# EAGLE design Light bar (EAGLE 7.2.0)
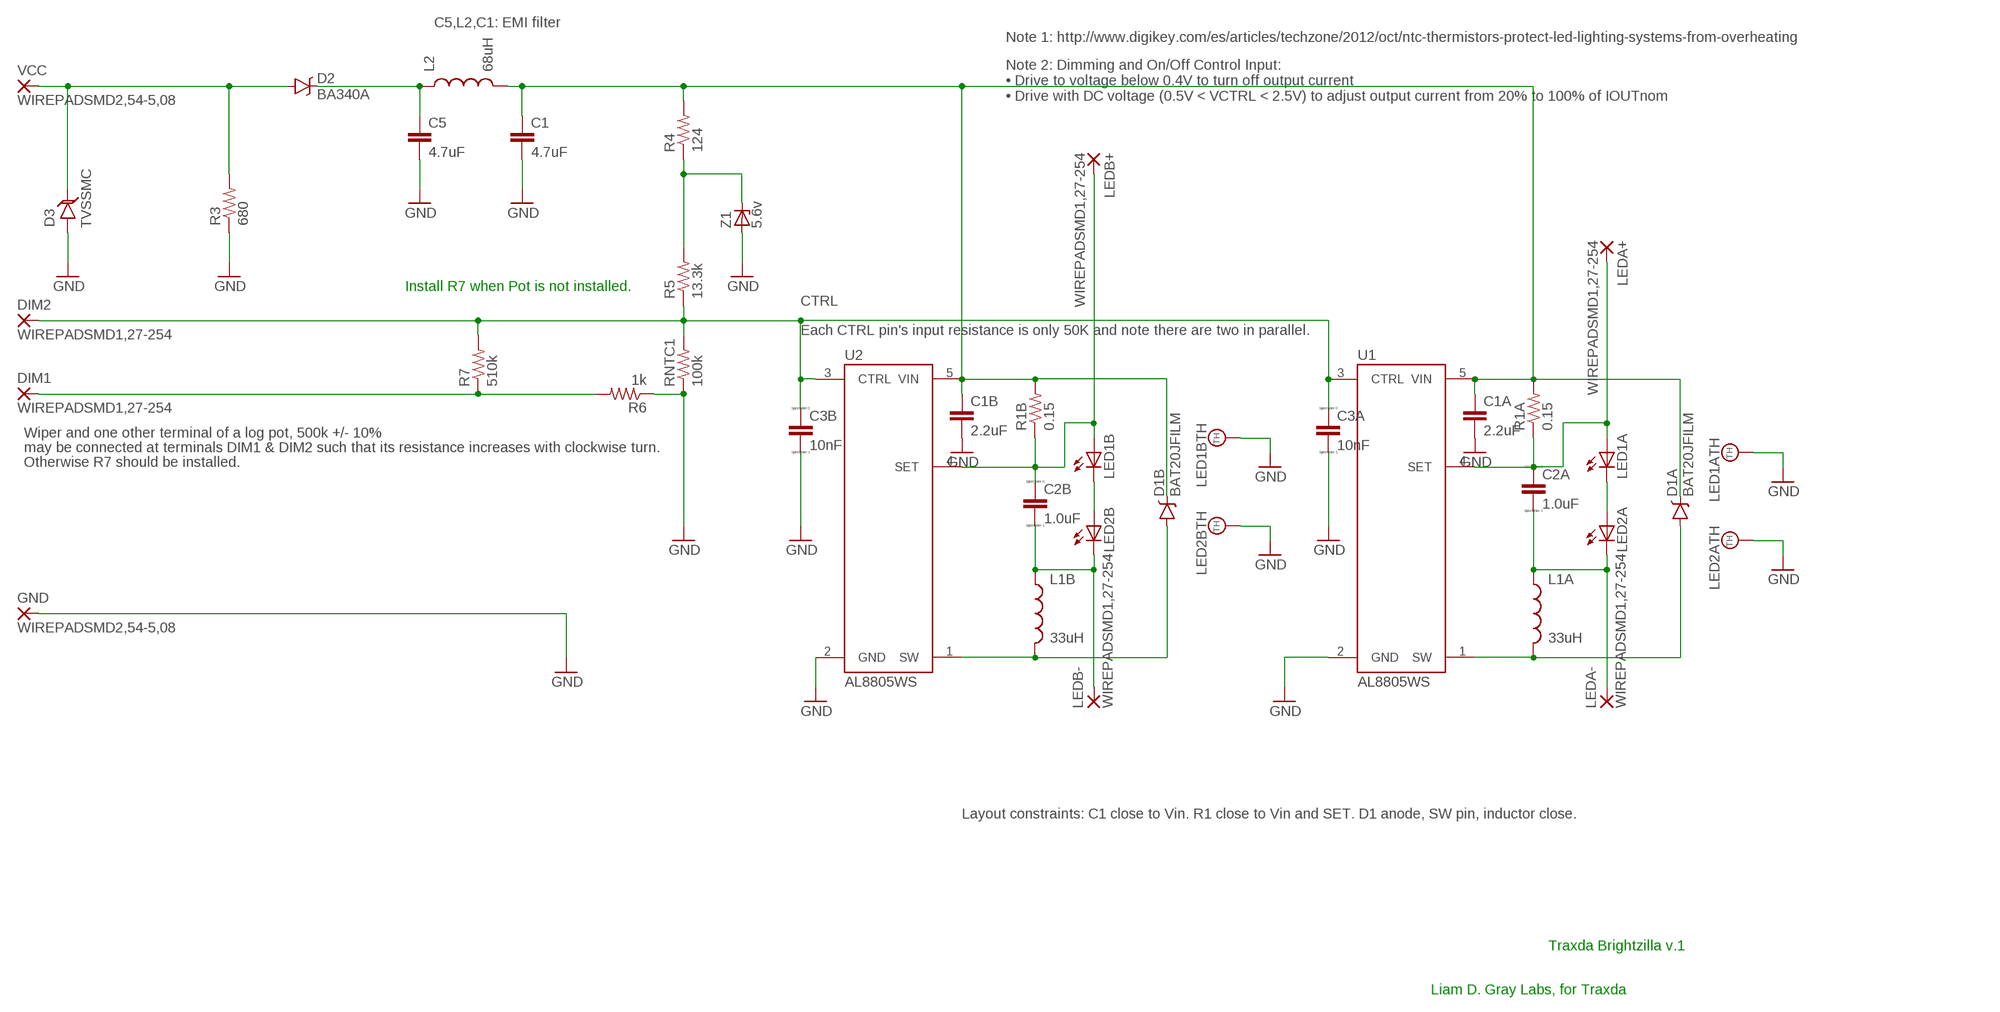
[diagram p0: schematic, sheet 1]

## Parts
C1  4.7uF  CAP1210  [1210]
C1A  2.2uF  2.2UF-25V-+80/-20(0805)  [0805]
C1B  2.2uF  2.2UF-25V-+80/-20(0805)  [0805]
C2A  1.0uF  1.0UF-25V-+80/-20(0805)  [0805]
C2B  1.0uF  1.0UF-25V-+80/-20(0805)  [0805]
C3A  10nF  10NF/10000PF-50V-10%(0603)  [0603-CAP]
C3B  10nF  CAP0603-CAP  [0603-CAP]
C5  4.7uF  CAP1210  [1210]
D1A  BAT20JFILM  [SOD-323]
D1B  BAT20JFILM  [SOD-323]
D2  BA340A  B340A  [SMA-DIODE]
D3  TVSSMC  [SMC]
DIM1  WIREPADSMD1,27-254  [SMD1,27-2,54]
DIM2  WIREPADSMD1,27-254  [SMD1,27-2,54]
GND  WIREPADSMD2,54-5,08  [SMD2,54-5,08]
L1A  33uH  INDUCTORNR6045T330MYUDEN_NR6045  [NR6045]
L1B  33uH  INDUCTORNR6045T330MYUDEN_NR6045  [NR6045]
L2  68uH  INDUCTORBOURNS_SRR1260  [SRR1260]
LED1A  LUXEON_REBEL  [LUXEON_REBEL_32MIL12MIL]
LED1B  LUXEON_REBEL  [LUXEON_REBEL_32MIL12MIL]
LED2A  LUXEON_REBEL  [LUXEON_REBEL_32MIL12MIL]
LED2B  LUXEON_REBEL  [LUXEON_REBEL_32MIL12MIL]
LEDA+  WIREPADSMD1,27-254  [SMD1,27-2,54]
LEDA-  WIREPADSMD1,27-254  [SMD1,27-2,54]
LEDB+  WIREPADSMD1,27-254  [SMD1,27-2,54]
LEDB-  WIREPADSMD1,27-254  [SMD1,27-2,54]
R1A  0.15  0.3OHM-1/8W-1%(0805)  [0805]
R1B  0.15  0.3OHM-1/8W-1%(0805)  [0805]
R3  680  RESISTOR2512  [R2512]
R4  124  R-US_R1210  [R1210]
R5  13.3k  R-US_R0805  [R0805]
R6  1k  RESISTOR0603-RES  [0603-RES]
R7  510k  RESISTOR0805-RES  [0805]
RNTC1  100k  RESISTOR0603-RES  [0603-RES]
U1  AL8805WS  AL8805  [SOT23-5]
U2  AL8805WS  AL8805  [SOT23-5]
VCC  WIREPADSMD2,54-5,08  [SMD2,54-5,08]
Z1  5.6v  ZENER-DIODESOD80C  [SOD80C]

## Nets
CTRL: C3A.1 C3B.1 DIM2.1(P) R5.1 R7.2 RNTC1.2 U1.3(CTRL) U2.3(CTRL)
GND: C1.2 C1A.2 C1B.2 C3A.2 C3B.2 C5.2 D3.A GND.1(P) LED1A.TH LED1A.TH@1(TH) LED1A.TH@2(TH) LED1A.TH@3(TH) LED1A.TH@4(TH) LED1B.TH LED1B.TH@1(TH) LED1B.TH@2(TH) LED1B.TH@3(TH) LED1B.TH@4(TH) LED2A.TH LED2A.TH@1(TH) LED2A.TH@2(TH) LED2A.TH@3(TH) LED2A.TH@4(TH) LED2B.TH LED2B.TH@1(TH) LED2B.TH@2(TH) LED2B.TH@3(TH) LED2B.TH@4(TH) R3.1 R6.1 RNTC1.1 U1.2(GND) U2.2(GND) Z1.A
N$1: DIM1.1(P) R6.2 R7.1
N$2: R4.1 R5.2 Z1.C
N$3: LED1B.C LED1B.C@1(C) LED2B.A LED2B.A@1(A)
N$4: LED1A.C LED1A.C@1(C) LED2A.A LED2A.A@1(A)
N$5: C5.1 D2.C L2.1
N$6: C2A.2 L1A.1 LED2A.C LED2A.C@1(C) LEDA-.1(P)
N$8: C2B.2 L1B.1 LED2B.C LED2B.C@1(C) LEDB-.1(P)
SET1: C2A.1 LED1A.A LED1A.A@1(A) LEDA+.1(P) R1A.1 U1.4(SET)
SET2: C2B.1 LED1B.A LED1B.A@1(A) LEDB+.1(P) R1B.1 U2.4(SET)
SW1: D1A.A L1A.2 U1.1(SW)
SW2: D1B.A L1B.2 U2.1(SW)
VCC: D2.A D3.C R3.2 VCC.1(P)
VIN: C1.1 C1A.1 C1B.1 D1A.C D1B.C L2.2 R1A.2 R1B.2 R4.2 U1.5(VIN) U2.5(VIN)

## Notes on the sheet
- C5,L2,C1: EMI filter
- Note 1: http://www.digikey.com/es/articles/techzone/2012/oct/ntc-thermistors-protect-led-lighting-systems-from-overheating
- Note 2: Dimming and On/Off Control Input:
  • Drive to voltage below 0.4V to turn off output current
  • Drive with DC voltage (0.5V < VCTRL < 2.5V) to adjust output current from 20% to 100% of IOUTnom
- Install R7 when Pot is not installed.
- Each CTRL pin's input resistance is only 50K and note there are two in parallel.
- Wiper and one other terminal of a log pot, 500k +/- 10%
- may be connected at terminals DIM1 & DIM2 such that its resistance increases with clockwise turn.
- Otherwise R7 should be installed.
- Layout constraints: C1 close to Vin. R1 close to Vin and SET. D1 anode, SW pin, inductor close.
- Traxda Brightzilla v.1
- Liam D. Gray Labs, for Traxda

## Library data of the parts
C1 C5 = SparkFun-Passives:CAP: Capacitor Standard 0603 ceramic capacitor, and 0.1" leaded capacitor.
C1A C1B = SparkFun-Capacitors:2.2UF-25V-+80/-20(0805): CAP-11624; PROD_ID: CAP-11624
C2A = SparkFun-Capacitors:1.0UF-25V-+80/-20(0805): CAP-11625; NEAR: U1 VIN; PROD_ID: CAP-11625
C2B = SparkFun-Capacitors:1.0UF-25V-+80/-20(0805): CAP-11625; PROD_ID: CAP-11625
C3A = SparkFun-Capacitors:10NF/10000PF-50V-10%(0603): CAP-00867; PROD_ID: CAP-00867
C3B = SparkFun-Capacitors:CAP: Capacitor Standard 0603 ceramic capacitor, and 0.1" leaded capacitor.
D1A D1B = SparkFun-DiscreteSemi:BAT20JFILM: 23V, 1A Schottky diode, SOD-323 package; PROD_ID: DIO-11623
D2 = SparkFun-DiscreteSemi:B340A: Schottky Diode 3A-40V; PROD_ID: DIO-09886
D3 = SparkFun-DiscreteSemi:TVS: Transient voltage suppressor- prevents ESD on inputs.
DIM1 DIM2 GND LEDA+ LEDA- LEDB+ LEDB- VCC = wirepad:WIREPAD: Wire PAD connect wire on PCB
L1A = SparkFun-Passives:INDUCTOR: Inductors Basic Inductor/Choke - 0603 and 1206. Footprints are not proven and vary greatly between part numbers. SRN6045- 33uH, 20% 1.4A SDR0403-560KL - 56uH, 10%, 500mA RMS/740mA peak; NEAR: SW and D1 anode; PROD_ID: NR6045T330M
L1B = SparkFun-Passives:INDUCTOR: Inductors Basic Inductor/Choke - 0603 and 1206. Footprints are not proven and vary greatly between part numbers. SRN6045- 33uH, 20% 1.4A SDR0403-560KL - 56uH, 10%, 500mA RMS/740mA peak; PROD_ID: NR6045T330M
L2 = SparkFun-Passives:INDUCTOR: Inductors Basic Inductor/Choke - 0603 and 1206. Footprints are not proven and vary greatly between part numbers. SRN6045- 33uH, 20% 1.4A SDR0403-560KL - 56uH, 10%, 500mA RMS/740mA peak; PROD_ID: NDUC-11627; VALUE: 33uH
LED1A LED1B LED2A LED2B = led:LUXEON_REBEL: LUXEON Rebel Display layer 93, Pins, and connect all contact points with a net. The thermal pads are defined in a separate gate with addlevel REQUEST. Draw a net named 'TH' and connect all thermal pads with it. Please read the Package's Description about DRC settings. Source: http://www.lumileds.com/pdfs/AB32.pdf
R1A = SparkFun-Resistors:0.3OHM-1/8W-1%(0805): RES-11622; NEAR: VIN & SET; PROD_ID: RES-11622; VALUE: 0.3
R1B = SparkFun-Resistors:0.3OHM-1/8W-1%(0805): RES-11622; PROD_ID: RES-11622; VALUE: 0.3
R3 R6 R7 RNTC1 = SparkFun-Passives:RESISTOR: Resistor Basic schematic elements and footprints for 0603, 1206, and PTH resistors.
R4 R5 = rcl:R-US_: RESISTOR, American symbol
U1 U2 = SparkFun-PowerIC:AL8805: Constant current LED driver PWM-able 1MHz switch freq 6V-36V Up to 1A LED current; PROD_ID: IC-11626
Z1 = diode:ZENER-DIODE: Z-Diode

## Board
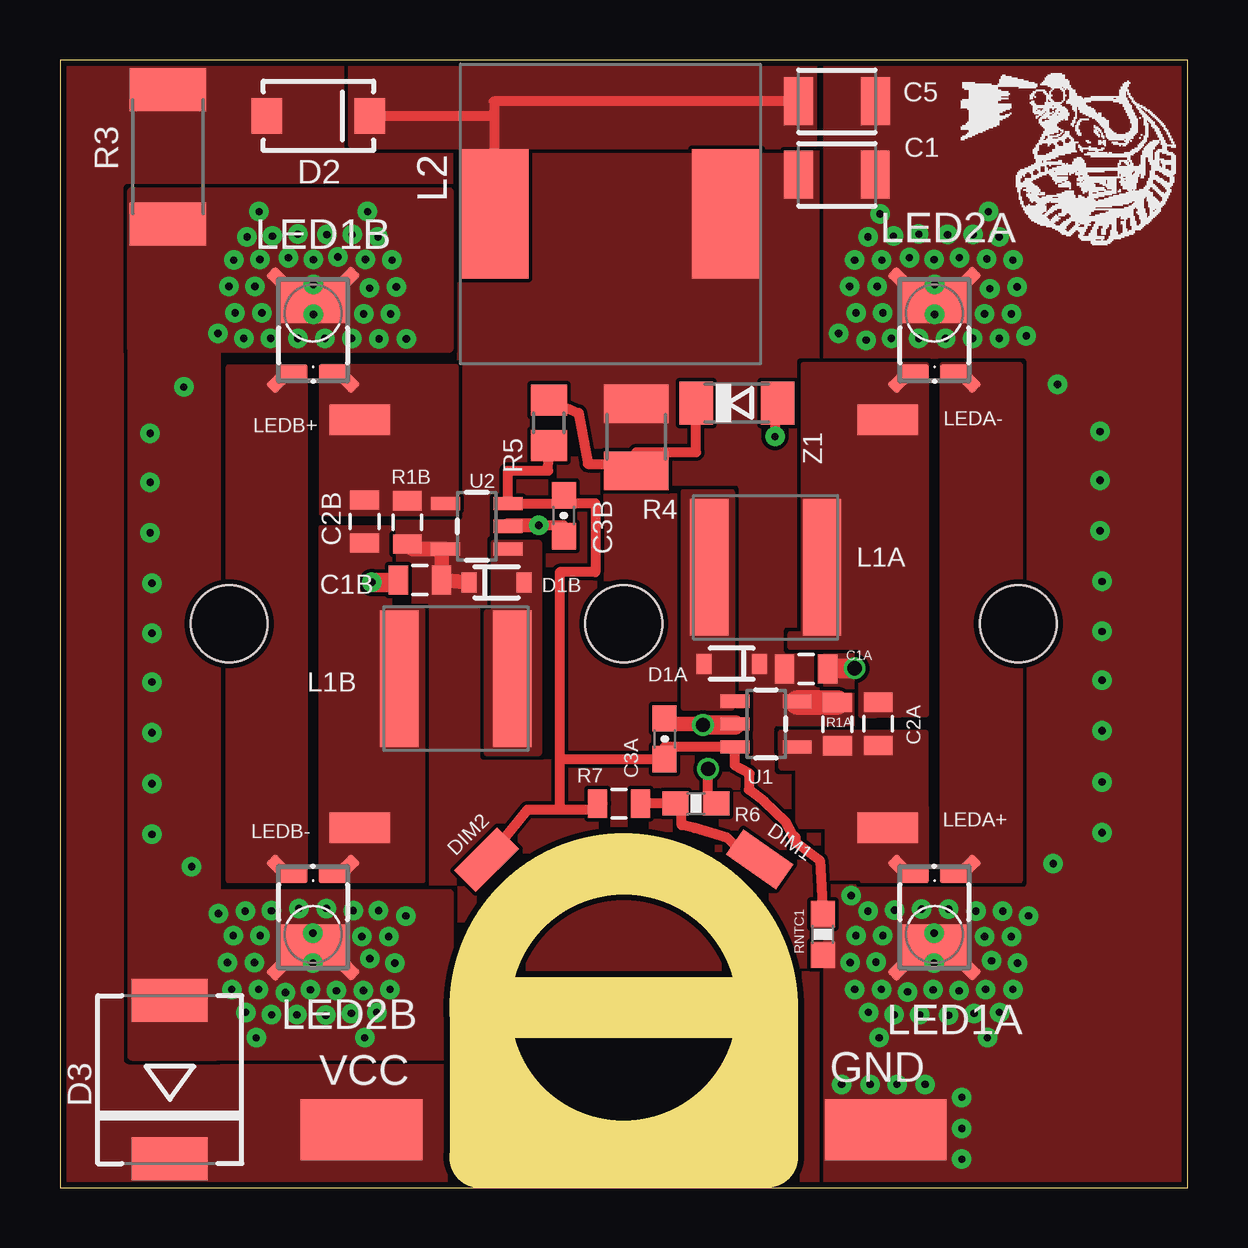
[diagram p1: board, top side]
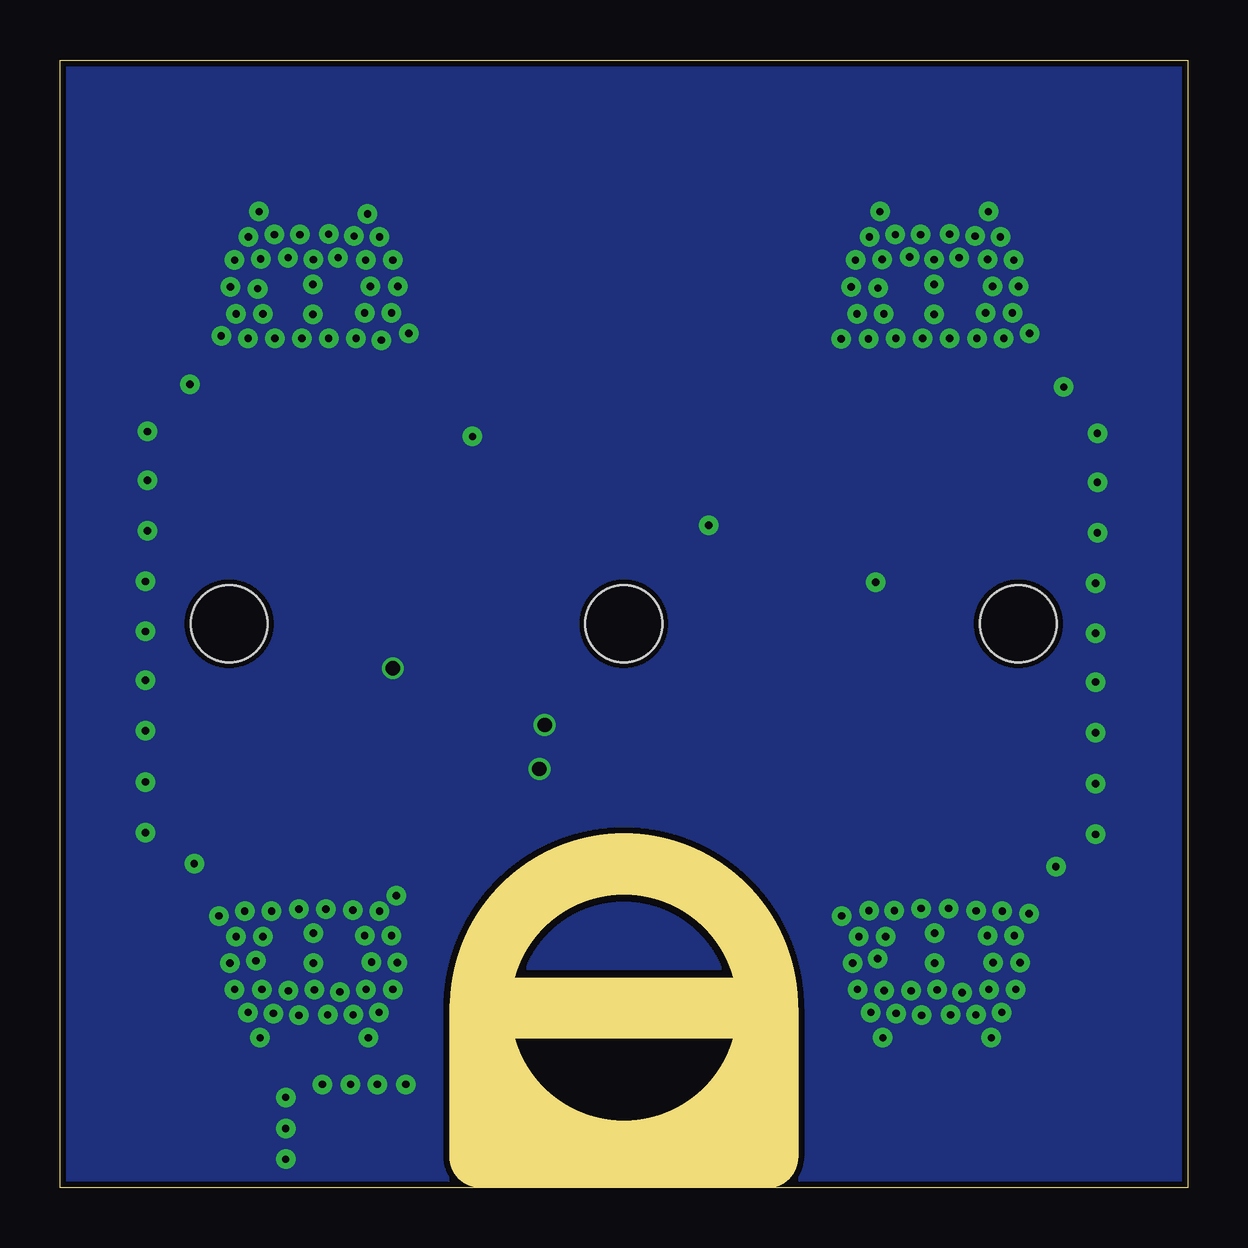
[diagram p2: board, bottom side, seen from below]

Size 47 x 47 mm. Coordinates in mm from the lower left corner, seen from the top.
Outline: 47,47 0,47 0,0 47,0 47,47
Outline: circle at 23.5,7.5 radius 5.98
Copper layers (1*16): Top 0.035mm / dielectric 1.5mm / Bottom 0.035mm
Design rules "ITead_rule": minimum track width 6mil, minimum drill 12mil, track to track 6mil, track to pad 6mil, pad to pad 6mil, via to via 6mil, smd to smd 0mil, copper to edge 10mil, drill to drill 10mil, minimum pad ring 10mil, minimum via ring 6mil, stop-mask expansion 2mil, vias tented up to drill 100mil, thermal gap 10mil
Holes 3.2 mm at 23.5,23.5 39.95,23.5 7.05,23.5
Milling: area 17.5,1.5 to 29.5,13.5; area 17.5,1.5 to 29.5,13.5; area 17.5,1.2 to 29.5,7.5

### Footprints (pad centres in the part's own frame; a part is rotated, then mirrored left to right if it is on the bottom)
1210 = smd 1.2 x 2: 1 -1.6,0; 2 1.6,0
0805 = smd 0.8 x 1.2: 1 -0.9,0; 2 0.9,0
0603-CAP = smd 1.1 x 1: 1 -0.85,0; 2 0.85,0
SOD-323 = smd 0.63 x 0.83: A 1.15,0; C -1.15,0
SMA-DIODE = smd 1.27 x 1.47: A -2.15,0; C 2.15,0
SMC = smd 1.778 x 3.175: A 3.302,0; C -3.302,0
SMD1,27-2,54 = smd 1.27 x 2.54: 1 0,0
SMD2,54-5,08 = smd 2.54 x 5.08: 1 0,0
NR6045 = smd 1.6 x 5.7: 1 -2.35,0; 2 2.35,0
SRR1260 = smd 2.9 x 5.4: 1 -4.85,0; 2 4.85,0
LUXEON_REBEL_32MIL12MIL = smd 1.26 x 0.73: A 0.87,-2.51; C -0.87,-2.51 | smd 1.1 x 0.57 rotated 315: A@1 1.39,-2.78 | smd 1.1 x 0.57 rotated 225: C@1 -1.39,-2.79 | smd 2.86 x 1.83: TH 0.01,0.49 | smd 1.1 x 0.57 rotated 135: TH@1 -1.39,1.37 | smd 1.1 x 0.57 rotated 45: TH@2 1.39,1.38 | drill 0.305 pad 0.813: TH@3 0.01,-0.06; TH@4 0.01,1.2
R2512 = smd 1.8 x 3.2: 1 -2.8,0; 2 2.8,0
R1210 = smd 1.6 x 2.7: 1 -1.4,0; 2 1.4,0
R0805 = smd 1.3 x 1.5: 1 -0.95,0; 2 0.95,0
0603-RES = smd 1.1 x 1: 1 -0.85,0; 2 0.85,0
SOT23-5 = smd 0.55 x 1.2: 1 -0.95,-1.3; 2 0,-1.3; 3 0.95,-1.3; 4 0.95,1.3; 5 -0.95,1.3
SOD80C = smd 1.4 x 1.8: A 1.7,0; C -1.7,0

### Placement (x,y rotation side)
C1  32.38,42.21 0 top
C1A  31.1,21.61 0 top
C1B  15,25.32 180 top
C2A  34.1,19.33 90 top
C2B  12.7,27.76 270 top
C3A  25.21,18.7 90 top
C3B  21,28 270 top
C5  32.39,45.27 0 top
D1A  28,21.83 180 top
D1B  18.2,25.23 0 top
D2  10.77,44.67 0 top
D3  4.58,4.5 90 top
DIM1  29.17,13.67 235 top
DIM2  17.78,13.67 315 top
DRILEGEND  [DRILEGEND]  -9.36,-13.39 0 top  (outside the outline)
GND  34.42,2.41 270 top
L1A  29.41,25.85 180 top
L1B  16.5,21.21 0 top
L2  22.94,40.58 0 top
LED1A  36.45,10.55 180 top
LED1B  10.55,36.45 0 top
LED2A  36.45,36.45 0 top
LED2B  10.55,10.55 180 top
LEDA+  34.5,15 90 top
LEDA-  34.5,32 90 top
LEDB+  12.5,32 90 top
LEDB-  12.5,15 90 top
R1A  32.4,19.32 90 top
R1B  14.48,27.73 270 top
R3  4.5,42.95 90 top
R4  24.02,31.27 90 top
R5  20.38,31.88 90 top
R6  26.51,16.01 180 top
R7  23.3,16 180 top
RNTC1  31.8,10.55 90 top
U1  29.43,19.32 270 top
U2  17.37,27.57 90 top
VCC  12.57,2.41 270 top
Z1  28.21,32.7 0 top

### Tracks (layer width: path | path; a pad name or v marks a point on that pad's centre or on a via)
CTRL
  Top 0.406: U1.3 28.12,17.6 28.74,17.26 28.74,16.58 | 28.74,16.58 29.39,16.07 30.24,15.26 30.57,14.63 30.65,14.63 30.65,14.4 31.67,13.64 RNTC1.2 | 28.7,16.58 28.74,16.58 | DIM2.1 19.47,15.75 20.83,15.75 | 22.62,16.03 R7.2 22.34,15.75 20.83,15.75 | 21,28.52 U2.3 18.68,29.88 20.35,29.88 R5.1 | 20.83,17.85 20.83,25.65 22.32,25.65 22.32,28.52 21,28.52 | 20.83,17.85 20.83,15.75 | U1.3 | U1.3 25.21,18.37 C3A.1 20.83,17.85 | 21,28.52 C3B.1
GND  (via drill 0.3 pad 0.81, 0.6)
  Top 0.406: 28.13,19.28 U1.2 | 32,21.64 C1A.2 | 13.64,25.23 C1B.2 | U2.2 | U2.2 18.82,27.57 | 18.82,27.57 | 19.77,27.5 19.77,27.52 v19.96,27.61 21,27.61 C3B.2 | 18.68,27.5 U2.2 | 26.8,19.32 v26.8,19.28 | 18.68,27.6 U2.2 | R6.1 27.01,16.35 v27.01,17.45 | 25.44,19.32 C3A.2 | v29.8,31.3 29.83,31.99 Z1.A
  Top 0.61: v19.96,27.61 18.68,27.6 | 26.8,19.32 25.44,19.32
  Top 0.813: v26.8,19.28 28.13,19.28 | v33.13,21.64 32,21.64 | v13,25.23 13.64,25.23
  Bottom 0.406: v19.96,27.61 19.79,27.52 | v27.01,17.45 27.05,17.53
  other vias: 33.77,4.3 36.06,4.3 37.59,3.76 37.59,2.46 37.59,1.18 34.89,4.3 32.58,4.3 9.92,35.4 8.78,35.4 11.04,35.4 12.16,35.4 8.42,36.46 12.66,36.42 8.13,37.56 12.9,37.49 8.33,38.68 12.73,38.68 10.56,38.68 9.53,38.76 11.58,38.79 7.66,35.4 7.3,36.46 13.78,36.42 7.04,37.56 14.02,37.54 7.24,38.66 13.84,38.66 7.8,39.62 13.26,39.62 9.92,39.74 11.12,39.72 8.86,39.66 12.18,39.72 6.58,35.6 8.3,40.68 12.82,40.68 37.04,11.61 38.18,11.52 35.92,11.61 34.8,11.56 38.54,10.46 34.3,10.5 38.84,9.45 34.01,9.4 38.58,8.26 34.24,8.26 36.4,8.24 37.48,8.2 35.33,8.15 39.3,11.52 33.68,11.52 39.66,10.46 33.18,10.5 39.92,9.36 32.94,9.38 39.72,8.26 33.12,8.26 39.16,7.3 33.7,7.3 37.04,7.18 35.84,7.2 38.1,7.26 34.78,7.2 40.38,11.32 38.66,6.24 34.14,6.24 35.8,35.4 34.66,35.4 36.92,35.4 38.04,35.4 34.3,36.46 38.54,36.42 34.06,37.56 38.76,37.47 34.26,38.66 38.63,38.71 36.44,38.68 35.41,38.76 37.49,38.76 39.16,35.4 33.18,36.46 39.66,36.42 32.92,37.56 39.9,37.54 33.12,38.66 39.72,38.66 33.68,39.62 39.14,39.62 35.8,39.74 37,39.72 34.74,39.66 38.06,39.72 32.46,35.6 40.28,35.5 34.18,40.59 38.7,40.68 9.96,11.63 8.81,11.53 12.58,10.46 8.34,10.5 12.92,9.54 8.1,9.38 12.65,8.2 8.28,8.26 10.44,8.24 11.52,8.2 9.4,8.13 7.72,11.52 13.7,10.46 7.22,10.5 13.96,9.36 6.98,9.38 13.76,8.26 7.16,8.26 13.2,7.3 7.74,7.3 11.08,7.18 9.88,7.2 12.14,7.26 8.82,7.2 14.42,11.32 6.6,11.42 12.7,6.24 8.18,6.24 33.6,35.32 13.3,35.38 14.44,35.38 11.1,11.63 12.22,11.54 13.28,11.54 32.98,12.17 5.16,33.36 3.76,31.43 3.76,29.4 3.76,27.29 3.84,25.19 3.84,23.1 3.84,21.07 3.84,18.96 3.84,16.83 3.84,14.72 5.49,13.38 43.44,25.26 43.44,23.18 43.44,21.15 43.44,19.04 43.44,16.91 43.44,14.8 43.36,31.51 43.36,29.48 43.36,27.37 41.4,13.5 41.59,33.48
  pour Bottom (isolate 0.305, no thermals): 47,0 47.03,47.01 0,47 0,0
  pour Bottom (rank 2): 47,0 47,47 0,47.01 0,0
  pour Top (no thermals): 3,41.5 16.2,41.5 16.2,35 3,35
  pour Top (no thermals): 5.08,12.24 16.2,12.24 16.2,5.5 5,5.5 5,12.2
  pour Top (no thermals): 3,34.8 3,5.5 6.5,5.5 6.5,34.8
  pour Top (rank 2, no thermals): 32,47 32,0 47,0 47,47
N$1
  Top 0.406: R7.1 24.4,16.01 R6.2 25.91,15.76 25.91,15.11 26.46,14.99 27.81,14.56 28.64,13.73 DIM1.1
N$2
  Top 0.406: Z1.C 26.52,30.64 24.02,30.64 R4.1 23.93,30.16 22,30.16 21.62,32.29 R5.2
N$3
  pour Top (no thermals): 7.04,34.2 10.2,34.2 10.2,12.8 7.04,12.8
N$4
  pour Top (no thermals): 36.8,34.3 40,34.3 40,12.8 36.8,12.8
N$5
  Top 0.406: L2.1 18.09,44.67 | 12.92,44.65 D2.C 18.09,44.67 | C5.1 18.09,45.27 18.09,44.67
  pour Top (no thermals): 12.2,47 12.2,43.48 31.37,43.5 31.37,47
N$6
  pour Top (no thermals): 31,34.3 36.1,34.3 36.1,19.72 34,19.68 33.4,19.68 33.4,22.54 30.45,22.52 30.45,23.07 31,23.1
N$8
  pour Top (no thermals): 10.9,27.5 13.72,27.5 13.72,24.08 15.1,24.08 15.1,12.8 10.9,12.8
SET1
  pour Top (no thermals): 30.05,18.98 36.08,18.96 36.1,12.8 33.45,12.8 33.45,12.9 32,12.9 32,15.05 30.77,15.05 30.77,17.5 30.08,17.5
SET2
  pour Top (no thermals): 10.9,28.12 16.5,28.1 16.5,34.2 10.9,34.2
SW1
  pour Top (no thermals): 26,29 28,29 28,20 26,20
SW2
  pour Top (no thermals): 19.96,18.1 17.8,18.1 17.8,23.98 18.09,23.98 18.09,26.89 19.96,26.89
VCC
  pour Top (rank 2, no thermals): 0,47 0,0 16.2,0 16.2,47
VIN
  Top 0.406: 30.73,20.22 U1.5 | 14.7,26.61 R1B.2 | U2.5 15.9,26.61 | 16.85,25.23 D1B.C
  Top 0.61: U2.5 14.7,26.61 | 15.9,26.61 C1B.1 16.85,25.23
  Top 1.016: R1A.2 30.73,20.22
  pour Top (rank 6, no thermals): 0,47 0,0 47,0 47,47
  pour Top (no thermals): 14.19,27.56 16.69,27.56 16.69,24.57 14.86,24.57 14.86,26.29 14.22,26.29

### Text on the board
DrillLegend: LAYER-STACK
DrillLegend_01-16: 01-16
DrillLegend_01-20: 01-20
FabDoc1: 0.8mm (31-40 mil) FR-4, 2-sided with 1-oz copper. Min drill 12mil. May use HASL for prototype (qty 1-4) but shall use ENIG for quantity 100 or greater. Solder mask: top only, any dark color acceptable for prototype, shall use red for production (qty 100 or greater). Silksdreen white, top only.